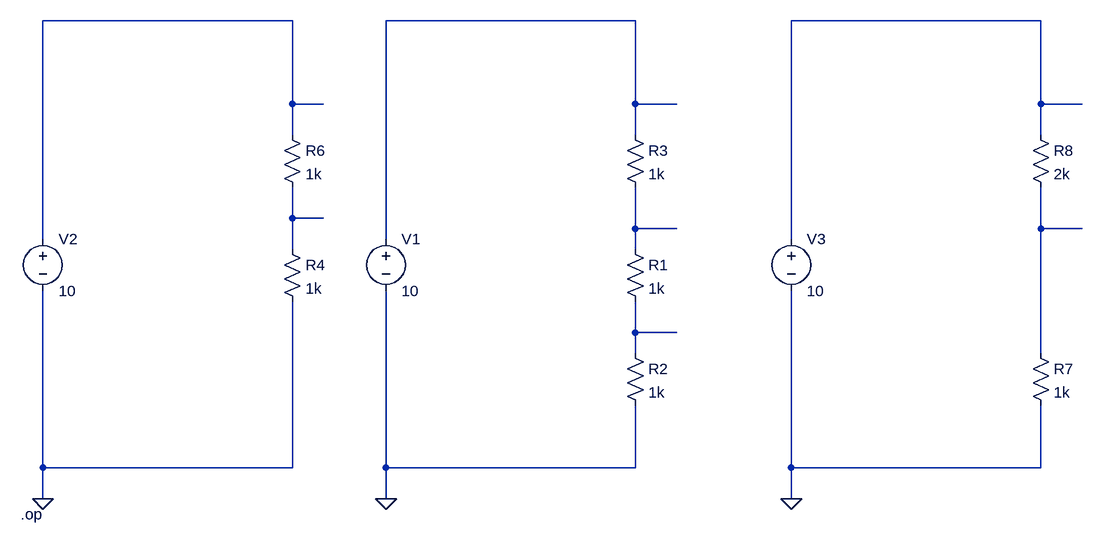
[diagram p0: schematic Voltage Dividers.asc]
Voltage Dividers.asc, the LTspice schematic file:
Version 4
SHEET 1 1100 680
WIRE -320 -256 -704 -256
WIRE 208 -256 -176 -256
WIRE 832 -256 448 -256
WIRE -320 -128 -320 -256
WIRE -272 -128 -320 -128
WIRE 208 -128 208 -256
WIRE 272 -128 208 -128
WIRE 832 -128 832 -256
WIRE 896 -128 832 -128
WIRE -320 -80 -320 -128
WIRE 208 -80 208 -128
WIRE 832 -80 832 -128
WIRE -320 48 -320 0
WIRE -272 48 -320 48
WIRE 208 64 208 0
WIRE 272 64 208 64
WIRE 832 64 832 0
WIRE 896 64 832 64
WIRE -704 80 -704 -256
WIRE -176 80 -176 -256
WIRE 448 80 448 -256
WIRE -320 96 -320 48
WIRE 208 96 208 64
WIRE 208 224 208 176
WIRE 272 224 208 224
WIRE 208 256 208 224
WIRE 832 256 832 64
WIRE -704 432 -704 160
WIRE -320 432 -320 176
WIRE -320 432 -704 432
WIRE -176 432 -176 160
WIRE 208 432 208 336
WIRE 208 432 -176 432
WIRE 448 432 448 160
WIRE 832 432 832 336
WIRE 832 432 448 432
WIRE -704 480 -704 432
WIRE -176 480 -176 432
WIRE 448 480 448 432
FLAG -176 480 0
FLAG -704 480 0
FLAG 448 480 0
DATAFLAG -272 -128 ""
DATAFLAG -272 48 ""
DATAFLAG 272 -128 ""
DATAFLAG 272 64 "round($*100)/100"
DATAFLAG 272 224 "round($*100)/100"
DATAFLAG 896 -128 ""
DATAFLAG 896 64 "round($*100)/100"
SYMBOL res 192 80 R0
SYMATTR InstName R1
SYMATTR Value 1k
SYMBOL res 192 240 R0
SYMATTR InstName R2
SYMATTR Value 1k
SYMBOL res 192 -96 R0
SYMATTR InstName R3
SYMATTR Value 1k
SYMBOL voltage -176 64 R0
WINDOW 123 0 0 Left 0
WINDOW 39 0 0 Left 0
SYMATTR InstName V1
SYMATTR Value 10
SYMBOL res -336 80 R0
SYMATTR InstName R4
SYMATTR Value 1k
SYMBOL res -336 -96 R0
SYMATTR InstName R6
SYMATTR Value 1k
SYMBOL voltage -704 64 R0
WINDOW 123 0 0 Left 0
WINDOW 39 0 0 Left 0
SYMATTR InstName V2
SYMATTR Value 10
SYMBOL res 816 240 R0
SYMATTR InstName R7
SYMATTR Value 1k
SYMBOL res 816 -96 R0
SYMATTR InstName R8
SYMATTR Value 2k
SYMBOL voltage 448 64 R0
WINDOW 123 0 0 Left 0
WINDOW 39 0 0 Left 0
SYMATTR InstName V3
SYMATTR Value 10
TEXT -738 504 Left 2 !.op

The netlist it stands for:
* Voltage Dividers.asc
R1 N005 N007 1k
R2 N007 0 1k
R3 N002 N005 1k
V1 N002 0 10
R4 N004 0 1k
R6 N001 N004 1k
V2 N001 0 10
R7 N006 0 1k
R8 N003 N006 2k
V3 N003 0 10
.op
.backanno
.end